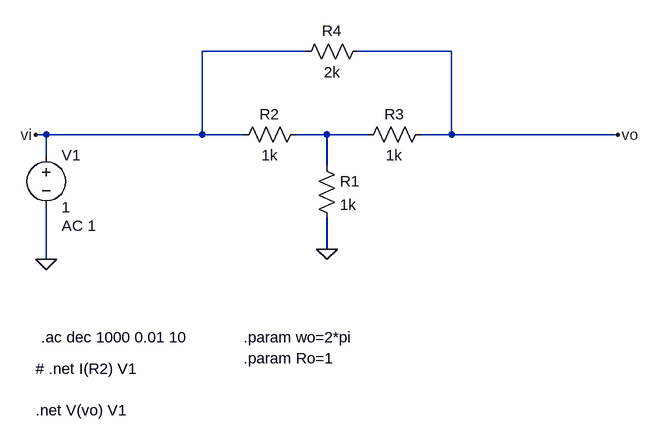
[diagram p0: schematic ejCuadripolos.asc]
ejCuadripolos.asc, the LTspice schematic file:
Version 4.1
SHEET 1 880 680
WIRE 128 -48 -32 -48
WIRE 352 -48 208 -48
WIRE -272 80 -288 80
WIRE -32 80 -32 -48
WIRE -32 80 -272 80
WIRE 32 80 -32 80
WIRE 160 80 112 80
WIRE 224 80 160 80
WIRE 352 80 352 -48
WIRE 352 80 304 80
WIRE 608 80 352 80
WIRE -272 112 -272 80
WIRE 160 128 160 80
WIRE 160 256 160 208
WIRE -272 272 -272 192
FLAG -288 80 vi
FLAG 608 80 vo
FLAG -272 272 0
FLAG 160 256 0
SYMBOL voltage -272 96 R0
WINDOW 123 24 124 Left 2
WINDOW 39 0 0 Left 0
SYMATTR Value2 AC 1
SYMATTR InstName V1
SYMATTR Value 1
SYMBOL res 144 112 R0
SYMATTR InstName R1
SYMATTR Value 1k
SYMBOL res 128 64 R90
WINDOW 0 0 56 VBottom 2
WINDOW 3 32 56 VTop 2
SYMATTR InstName R2
SYMATTR Value 1k
SYMBOL res 320 64 R90
WINDOW 0 0 56 VBottom 2
WINDOW 3 32 56 VTop 2
SYMATTR InstName R3
SYMATTR Value 1k
SYMBOL res 224 -64 R90
WINDOW 0 0 56 VBottom 2
WINDOW 3 32 56 VTop 2
SYMATTR InstName R4
SYMATTR Value 2k
TEXT -280 392 Left 2 !.ac dec 1000 0.01 10
TEXT -288 440 Left 2 !# .net I(R2) V1
TEXT -288 504 Left 2 !.net V(vo) V1
TEXT 32 392 Left 2 !.param wo=2*pi
TEXT 32 424 Left 2 !.param Ro=1

The netlist it stands for:
* ejCuadripolos.asc
V1 vi 0 1 AC 1
R1 N001 0 1k
R2 N001 vi 1k
R3 vo N001 1k
R4 vo vi 2k
.ac dec 1000 0.01 10
# .net I(R2) V1
.net V(vo) V1
.param wo=2*pi
.param Ro=1
.backanno
.end